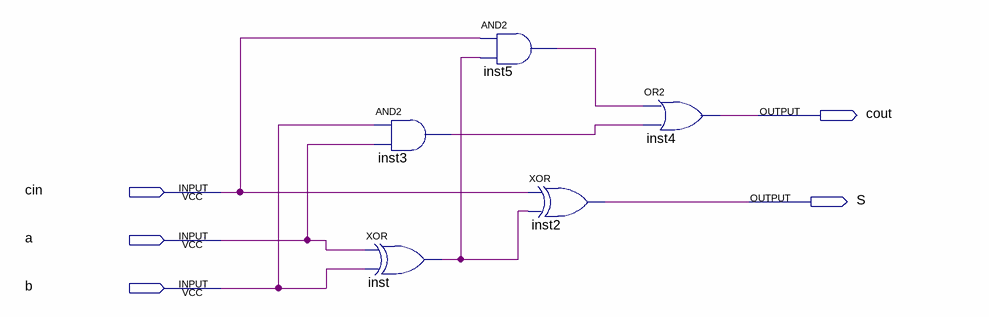
[diagram p0: schematic sheet]
// Quartus schematic 1adder.bdf as structural Verilog: 5 symbols, 5 pins
module \1adder  (
  input  cin,
  input  a,
  input  b,
  output cout,
  output S
);

  wire inst3_out, inst5_out, inst_out;

  and inst3 (inst3_out, b, a);
  xor inst (inst_out, a, b);
  and inst5 (inst5_out, cin, inst_out);
  xor inst2 (S, cin, inst_out);
  or inst4 (cout, inst5_out, inst3_out);
endmodule
